# EAGLE schematic NodeNadelAdapter_v1_2 (EAGLE 6.1)
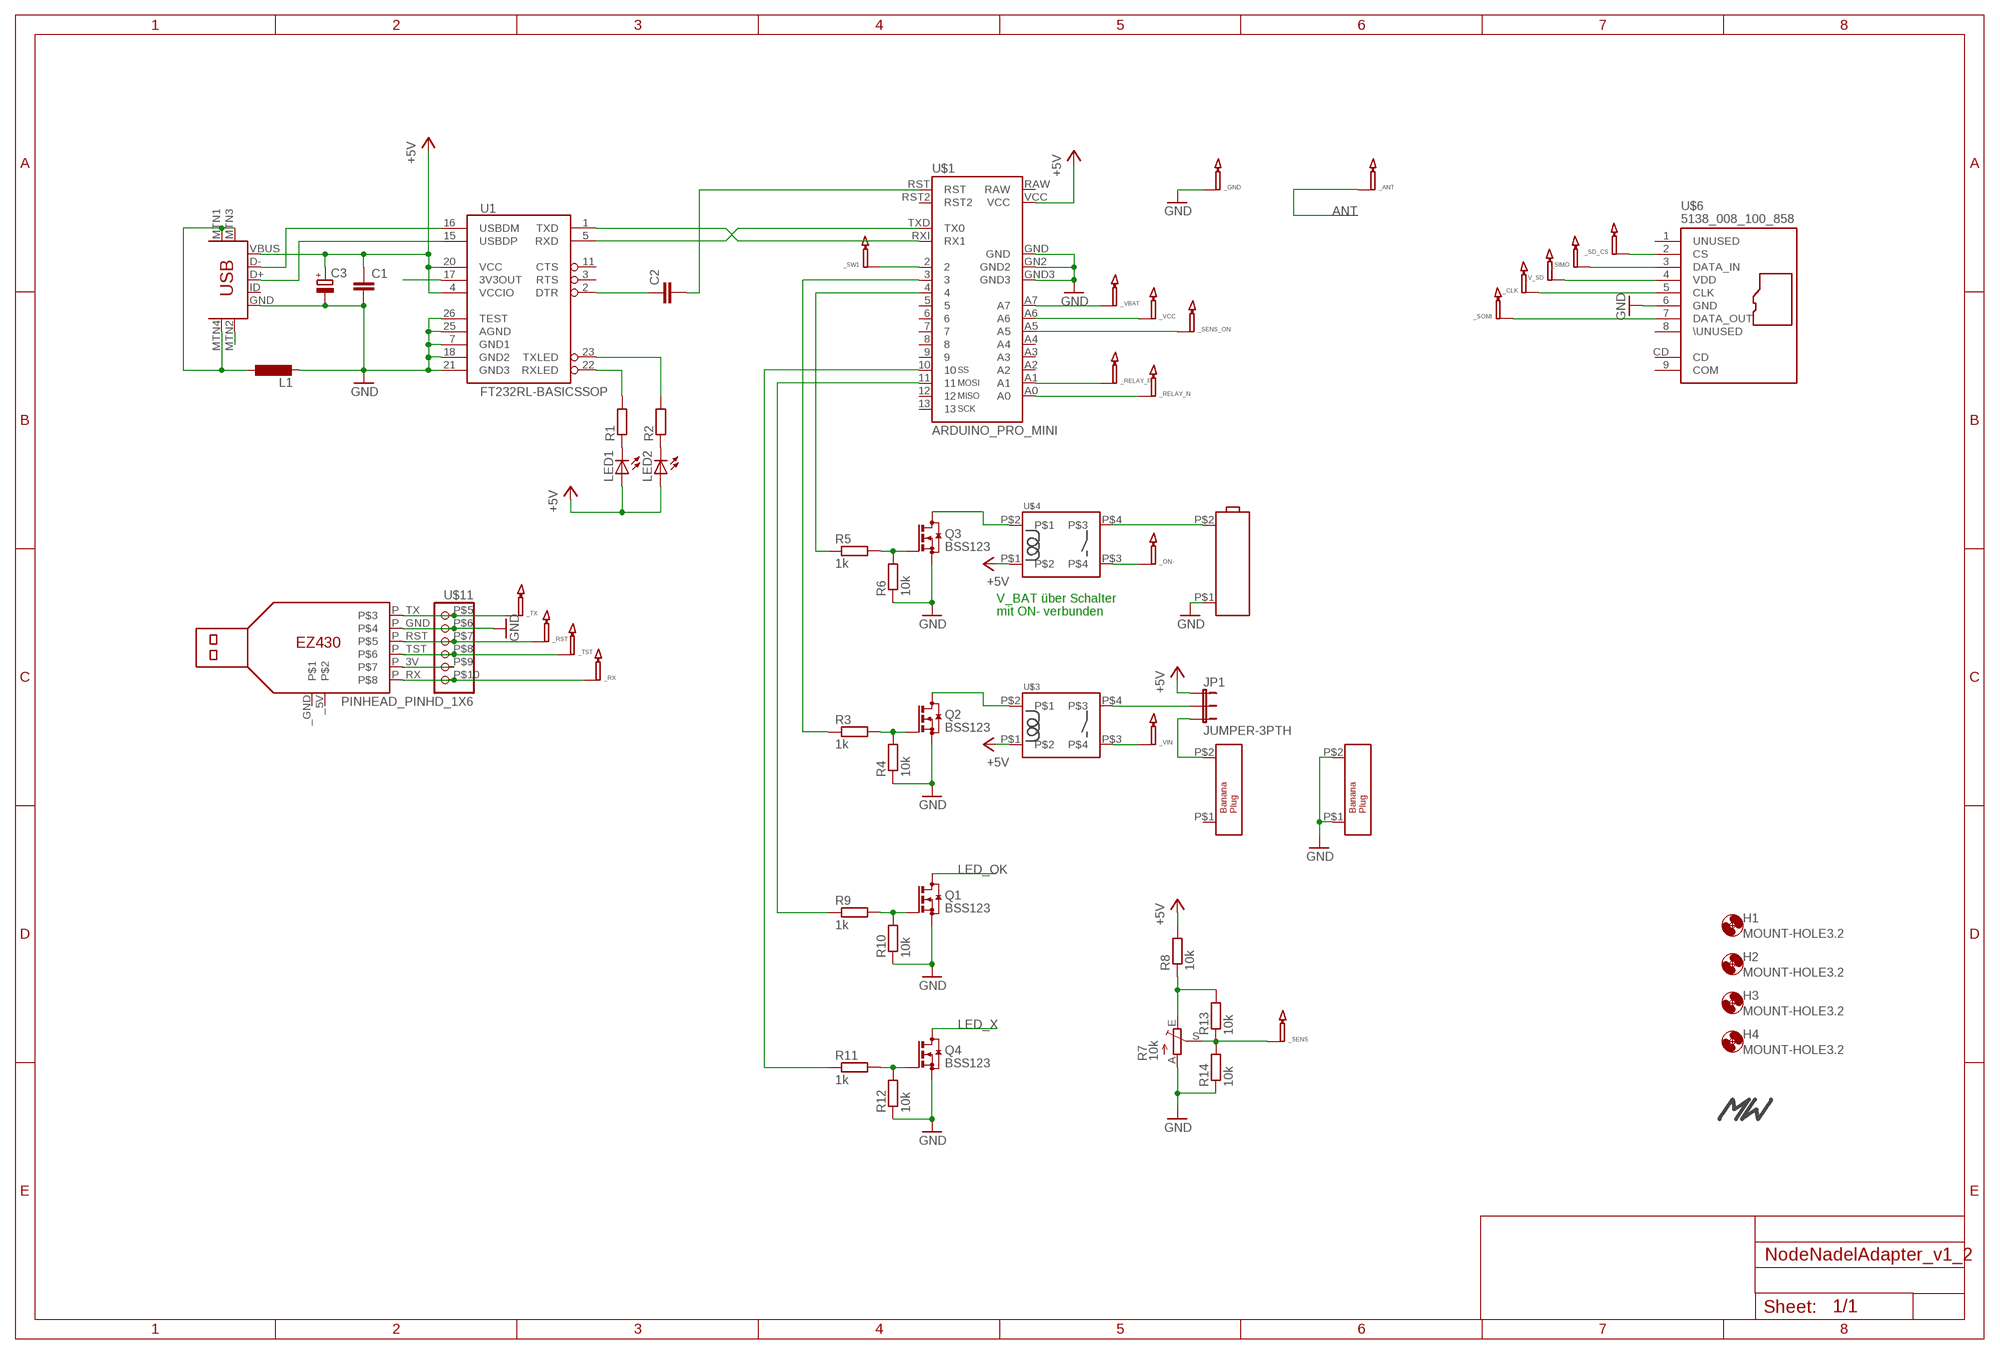
[diagram p0: schematic, sheet 1]

## Parts
_ANT  POGO_PINH  [POGO_PIN_V1.5]
_CLK  POGO_PINV  [POGO_PIN_V0.9]
_GND  POGO_PINV  [POGO_PIN_V0.9]
_ON-  POGO_PINH  [POGO_PIN_V1.5]
_RELAY_N  POGO_PINH  [POGO_PIN_V1.5]
_RELAY_P  POGO_PINH  [POGO_PIN_V1.5]
_RST  POGO_PINV  [POGO_PIN_V0.9]
_RX  POGO_PINV  [POGO_PIN_V0.9]
_SD_CS  POGO_PINV  [POGO_PIN_V0.9]
_SENS  POGO_PINH  [POGO_PIN_V1.5]
_SENS_ON  POGO_PINH  [POGO_PIN_V1.5]
_SIMO  POGO_PINV  [POGO_PIN_V0.9]
_SOMI  POGO_PINV  [POGO_PIN_V0.9]
_SW1  POGO_PINV  [POGO_PIN_V0.9]
_TST  POGO_PINV  [POGO_PIN_V0.9]
_TX  POGO_PINV  [POGO_PIN_V0.9]
_V_SD  POGO_PINV  [POGO_PIN_V0.9]
_VBAT  POGO_PINH  [POGO_PIN_V1.5]
_VCC  POGO_PINH  [POGO_PIN_V1.5]
_VIN  POGO_PINH  [POGO_PIN_V1.5]
C1  C-EUC0603  [C0603]
C2  C-EUC0603  [C0603]
C3  CPOL-EUSMCA  [SMC_A]
H1  MOUNT-HOLE3.2  [3,2]
H2  MOUNT-HOLE3.2  [3,2]
H3  MOUNT-HOLE3.2  [3,2]
H4  MOUNT-HOLE3.2  [3,2]
JP1  JUMPER-3PTH  [1X03]
L1  L-EUL2012C  [L2012C]
LED1  LEDSML0805  [SML0805]
LED2  LEDSML0805  [SML0805]
Q1  BSS123  [SOT23]
Q2  BSS123  [SOT23]
Q3  BSS123  [SOT23]
Q4  BSS123  [SOT23]
R1  R-EU_R0603  [R0603]
R2  R-EU_R0603  [R0603]
R3  1k  R-EU_R0603  [R0603]
R4  10k  R-EU_R0603  [R0603]
R5  1k  R-EU_R0603  [R0603]
R6  10k  R-EU_R0603  [R0603]
R7  10k  TRIM_EU-CA6V  [CA6V]
R8  10k  R-EU_R0603  [R0603]
R9  1k  R-EU_R0603  [R0603]
R10  10k  R-EU_R0603  [R0603]
R11  1k  R-EU_R0603  [R0603]
R12  10k  R-EU_R0603  [R0603]
R13  10k  R-EU_R0603  [R0603]
R14  10k  R-EU_R0603  [R0603]
U1  FT232RL-BASICSSOP  [SSOP28DB]
U$1  ARDUINO_PRO_MINI  [ARDUINO_PRO_MINI]
U$2  BANANA_PLUG  [BANANA_PLUG]
U$3  RELAY_ZETTLER_AZ767  [RELAY_ZETTLER_AZ767]
U$4  RELAY_ZETTLER_AZ767  [RELAY_ZETTLER_AZ767]
U$5  EZ430  [EZ430]
U$6  5138_008_100_858  [5138_008_100_858]
U$7  USB-MINIB-5PIN  [USB-MINIB]
U$8  AA_BATERIE_HALTER  [AA_BATERIE_HALTER]
U$9  BANANA_PLUG  [BANANA_PLUG]
U$10  MW_LOGO  [MW_11X5MM]
U$11  PINHEAD_PINHD_1X6  [PINHEAD_1X6S]

## Nets
+5V: C1.1 C3.+ JP1.1 LED1.A LED2.A R8.2 U1.4(VCCIO) U1.20(VCC) U$1.VCC U$3.P$1 U$4.P$1 U$7.VBUS
ANT: _ANT.P$1
GND: _GND.P$1 C1.2 C3.- L1.2 Q1.2(S) Q2.2(S) Q3.2(S) Q4.2(S) R4.1 R6.1 R7.A R10.1 R12.1 R14.1 U1.7(GND1) U1.18(GND2) U1.21(GND3) U1.25(AGND) U1.26(TEST) U$1.GN2(GND2) U$1.GND U$1.GND3 U$5.P_GND U$6.6(GND) U$7.GND U$8.P$1 U$9.P$1 U$9.P$2 U$11.P$6
LED_OK: Q1.3(D)
LED_X: Q4.3(D)
N$1: U$7.MTN2(MTN3)
N$2: Q2.3(D) U$3.P$2
N$3: Q3.3(D) U$4.P$2
N$4: _SW1.P$1 U$1.2
N$5: Q2.1(G) R3.2 R4.2
N$6: Q3.1(G) R5.2 R6.2
N$7: _TX.P$1 U$5.P_TX U$11.P$5
N$8: _RST.P$1 U$5.P_RST U$11.P$7
N$9: _TST.P$1 U$5.P_TST U$11.P$8
N$10: _RX.P$1 U$5.P_RX U$11.P$10
N$11: _CLK.P$1 U$6.5(CLK)
N$12: _SD_CS.P$1 U$6.2(CS)
N$13: _SIMO.P$1 U$6.3(DATA_IN)
N$14: _SOMI.P$1 U$6.7(DATA_OUT)
N$15: _V_SD.P$1 U$6.4(VDD)
N$16: _RELAY_N.P$1 U$1.A0
N$17: _RELAY_P.P$1 U$1.A1
N$18: U$4.P$4 U$8.P$2
N$19: _ON-.P$1 U$4.P$3
N$20: U1.1(TXD) U$1.RXI(RX1)
N$21: _VBAT.P$1 U$1.A7
N$22: _VCC.P$1 U$1.A6
N$23: R5.1 U$1.4
N$24: R3.1 U$1.3
N$25: U1.16(USBDM) U$7.D-
N$26: U1.15(USBDP) U$7.D+
N$27: R2.2 U1.23(TXLED)
N$28: JP1.2 U$3.P$4
N$29: L1.1 U$7.MTN1(MTN2) U$7.MTN3(MTN1) U$7.MTN4
N$30: U1.5(RXD) U$1.TXD(TX0)
N$31: _VIN.P$1 U$3.P$3
N$32: LED1.C R1.1
N$33: LED2.C R2.1
N$34: JP1.3 U$2.P$2
N$35: R1.2 U1.22(RXLED)
N$36: _SENS_ON.P$1 U$1.A5
N$37: R7.E R8.1 R13.2
N$38: _SENS.P$1 R7.S R13.1 R14.2
N$39: C2.1 U1.2(DTR)
N$40: Q1.1(G) R9.2 R10.2
N$41: R9.1 U$1.11
N$42: U1.17(3V3OUT)
N$43: Q4.1(G) R11.2 R12.2
N$44: R11.1 U$1.10
N$45: U$5.P_3V U$11.P$9
N$47: C2.2 U$1.RST
Unconnected: U1.3(RTS) U1.11(CTS) U$1.5 U$1.6 U$1.7 U$1.8 U$1.9 U$1.12 U$1.13 U$1.A2 U$1.A3 U$1.A4 U$1.RAW U$1.RST2 U$2.P$1 U$5._5V U$5._GND U$6.1(UNUSED) U$6.8(\UNUSED) U$6.9(COM) U$6.CD U$7.ID

## Notes on the sheet
- V_BAT über Schalter
- mit ON- verbunden

## Library data of the parts
_ANT _CLK _GND _ON- _RELAY_N _RELAY_P _RST _RX _SD_CS _SENS _SENS_ON _SIMO _SOMI _SW1 _TST _TX _V_SD _VBAT _VCC _VIN = Matthias:POGO_PIN
C1 C2 = rcl:C-EU: CAPACITOR, European symbol
C3 = rcl:CPOL-EU: POLARIZED CAPACITOR, European symbol
H1-H4 = holes:MOUNT-HOLE: MOUNTING HOLE with drill center marker
JP1 = SparkFun:JUMPER-3
L1 = rcl:L-EU: INDUCTOR, European symbol
LED1 LED2 = led:LED: LED OSRAM: - CHIPLED LG R971, LG N971, LY N971, LG Q971, LY Q971, LO R971, LY R971 LH N974, LH R974 LS Q976, LO Q976, LY Q976 LO Q996 - Hyper CHIPLED LW Q18S LB Q993, LB Q99A, LB R99A - SideLED LS A670, LO A670, LY A670, LG A670, LP A670 LB A673, LV A673, LT A673, LW A673 LH A674 LY A675 LS A676, LA A676, LO A676, LY A676, LW A676 LS A679, LY A679, LG A679 - Hyper Micro SIDELED® LS Y876, LA Y876, LO Y876, LY Y876 LT Y87S - SmartLED LW L88C, LW L88S LB L89C, LB L89S, LG L890 LS L89K, LO L89K, LY L89K LS L896, LA L896, LO L896, LY L896 - TOPLED LS T670, LO T670, LY T670, LG T670, LP T670 LSG T670, LSP T670, LSY T670, LOP T670, LYG T670 LG T671, LOG T671, LSG T671 LB T673, LV T673, LT T673, LW T673 LH T674 LS T676, LA T676, LO T676, LY T676, LB T676, LH T676, LSB T676, LW T676 LB T67C, LV T67C, LT T67C, LS T67K, LO T67K, LY T67K, LW E67C LS E67B, LA E67B, LO E67B, LY E67B, LB E67C, LV E67C, LT E67C LW T67C LS T679, LY T679, LG T679 LS T770, LO T770, LY T770, LG T770, LP T770 LB T773, LV T773, LT T773, LW T773 LH T774 LS E675, LA E675, LY E675, LS T675 LS T776, LA T776, LO T776, LY T776, LB T776 LHGB T686 LT T68C, LB T68C - Hyper Mini TOPLED® LB M676 - Mini TOPLED Santana® LG M470 LS M47K, LO M47K, LY M47K Source: http://www.osram.convergy.de LUXEON: - LUMILED® LXK2-PW12-R00, LXK2-PW12-S00, LXK2-PW14-U00, LXK2-PW14-V00 LXK2-PM12-R00, LXK2-PM12-S00, LXK2-PM14-U00 LXK2-PE12-Q00, LXK2-PE12-R00, LXK2-PE12-S00, LXK2-PE14-T00, LXK2-PE14-U00 LXK2-PB12-K00, LXK2-PB12-L00, LXK2-PB12-M00, LXK2-PB14-N00, LXK2-PB14-P00, LXK2-PB14-Q00 LXK2-PR12-L00, LXK2-PR12-M00, LXK2-PR14-Q00, LXK2-PR14-R00 LXK2-PD12-Q00, LXK2-PD12-R00, LXK2-PD12-S00 LXK2-PH12-R00, LXK2-PH12-S00 LXK2-PL12-P00, LXK2-PL12-Q00, LXK2-PL12-R00 Source: www.luxeon.com KINGBRIGHT: KA-3528ASYC Source: www.kingbright.com
Q1-Q4 = transistor-small-signal:BSS123: N-CHANNEL MOS FET
R1-R6 R8-R14 = rcl:R-EU_: RESISTOR, European symbol
R7 = pot:TRIM_EU-: POTENTIOMETER
U1 = SparkFun:FT232RL-BASIC: USB UART This is the simplified version of the FT232RL unit. Only what you need, nothing you don't. Spark Fun Electronics SKU : COM-00650
U$1 = SparkFun:ARDUINO_PRO_MINI
U$2 U$9 = Matthias:BANANA_PLUG: Conrad http://www.conrad.de/ce/de/product/735206/Pruefbuchse-Buchse-Einbau-vertikal-Stift-4-mm-Schwarz-SKS-Hirschmann-PB-4-1-St?ref=list
U$3 U$4 = SparkFun:RELAY_ZETTLER_AZ767: http://www.conrad.de/ce/de/product/503633/Subminiatur-Leistungs-Relais-AZ767-10-A-Zettler-Electronics-AZ767-1A-6DE-6-VDC-1-Schliesser-Max-DC-5-AAC-10-A-Max?queryFromSuggest=true
U$5 = Matthias:EZ430
U$6 = con-kyocera-elco:5138_008_100_858
U$7 = SparkFun:USB-MINIB: Mini-USB "B" connector with 5th pin broken out. Created new symbol breaking out 5th "ID" pin in mini/micro USB connector spec. See: http://en.wikipedia.org/wiki/Mini_usb#Cables. Uses same footprint as 4-pin symbol. Also added pins to connect to mounting / shield pads if required (probably not generally needed as signals aren't shielded once they leave the connector).
U$8 = Matthias:AA_BATERIE_HALTER
U$10 = MWlogo:MW_LOGO
U$11 = 1_27:PINHEAD_PINHD_1X6